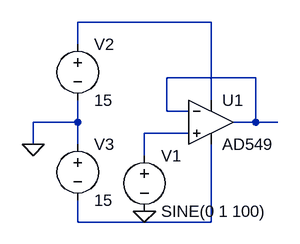
[diagram p0: schematic Voltagefollower.asc]
Voltagefollower.asc, the LTspice schematic file:
Version 4
SHEET 1 880 680
WIRE 192 -16 0 -16
WIRE 0 16 0 -16
WIRE 256 64 128 64
WIRE 192 96 192 -16
WIRE 128 112 128 64
WIRE 160 112 128 112
WIRE 0 128 0 96
WIRE 0 128 -64 128
WIRE 256 128 256 64
WIRE 256 128 224 128
WIRE 288 128 256 128
WIRE 160 144 96 144
WIRE -64 160 -64 128
WIRE 0 160 0 128
WIRE 96 176 96 144
WIRE 0 272 0 240
WIRE 192 272 192 160
WIRE 192 272 0 272
FLAG 96 256 0
FLAG -64 160 0
SYMBOL Opamps\\AD549 192 64 R0
SYMATTR InstName U1
SYMBOL voltage 96 160 R0
WINDOW 123 0 0 Left 0
WINDOW 39 0 0 Left 0
SYMATTR InstName V1
SYMATTR Value SINE(0 1 100)
SYMBOL voltage 0 0 R0
WINDOW 123 0 0 Left 0
WINDOW 39 0 0 Left 0
SYMATTR InstName V2
SYMATTR Value 15
SYMBOL voltage 0 144 R0
WINDOW 123 0 0 Left 0
WINDOW 39 0 0 Left 0
SYMATTR InstName V3
SYMATTR Value 15

The netlist it stands for:
* Voltagefollower.asc
XU1 N003 N002 N001 N004 N002 AD549  ; pins In+ In- V+ V- OUT
V1 N003 0 SINE(0 1 100)
V2 N001 0 15
V3 0 N004 15
.backanno
.end